# EAGLE design battiny_power_breakout (EAGLE 9.6.2)
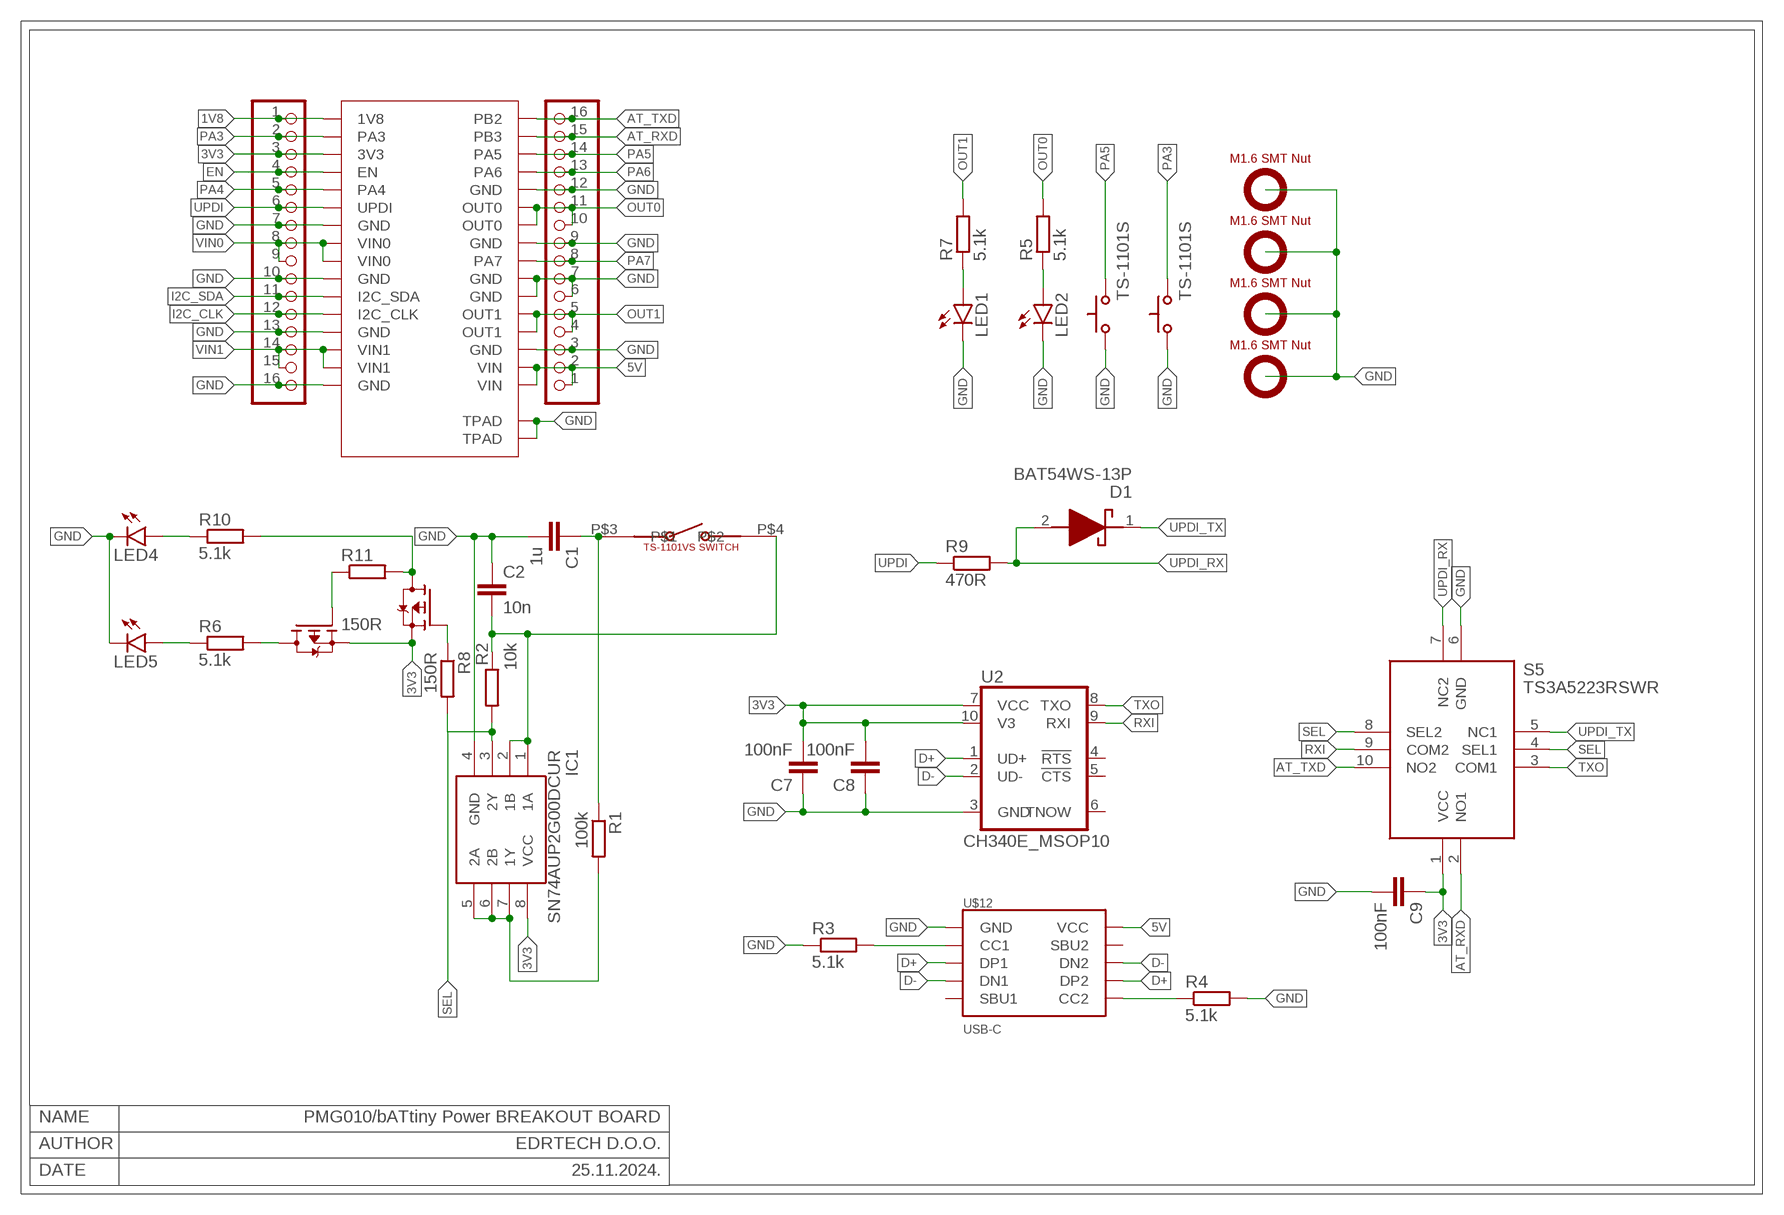
[diagram p0: schematic, sheet 1]

## Parts
C1  1u  C-EUC0402  [C0402]
C2  10n  C-EUC0402  [C0402]
C7  100nF  C-EUC0402  [C0402]
C8  100nF  C-EUC0402  [C0402]
C9  100nF  C-EUC0402  [C0402]
D1  BAT54WS-13P  [SOD2512X115N]
IC1  SN74AUP2G00DCUR  [SOP50P310X90-8N]
JP1  PINHD-1X16  [1X16]
JP2  PINHD-1X16  [1X16]
LED1  LEDCHIP-LED0603  [CHIP-LED0603]
LED2  LEDCHIP-LED0603  [CHIP-LED0603]
LED4  LEDCHIP-LED0603  [CHIP-LED0603]
LED5  LEDCHIP-LED0603  [CHIP-LED0603]
Q1  NTK3139PT1G  [SOTFL40P120X55-3N]
Q2  NTK3139PT1G  [SOTFL40P120X55-3N]
R1  100k  R-EU_R0402  [R0402]
R2  10k  R-EU_R0402  [R0402]
R3  5.1k  R-EU_R0402  [R0402]
R4  5.1k  R-EU_R0402  [R0402]
R5  5.1k  R-EU_R0402  [R0402]
R6  5.1k  R-EU_R0402  [R0402]
R7  5.1k  R-EU_R0402  [R0402]
R8  150R  R-EU_R0402  [R0402]
R9  470R  R-EU_R0402  [R0402]
R10  5.1k  R-EU_R0402  [R0402]
R11  150R  R-EU_R0402  [R0402]
S5  TS3A5223RSWR  [RSW(RPUQFNN10)]
U2  CH340E_MSOP10  [MSOP10]
U$1  TS-1101S  [TS-1101S]
U$2  TS-1101VS-C-A-A  [TS-1101VS-C-A-A]
U$3  PMG010  [PMG010]
U$4  TS-1101S  [TS-1101S]
U$8  SMTSO16  [SMTSO16]
U$9  SMTSO16  [SMTSO16]
U$10  SMTSO16  [SMTSO16]
U$11  SMTSO16  [SMTSO16]
U$12  USB-C  [USB-C]

## Nets
1V8: JP1.1 U$3.P$1(1V8)
3V3: C7.2 C8.2 C9.1 IC1.8(VCC) JP1.3 Q1.2(S) Q2.2(S) S5.1(VCC) U2.7(VCC) U2.10(V3) U$3.P$3(3V3)
5V: JP2.1 JP2.2 U$3.P$17(VIN) U$3.P$18(VIN) U$12.VCC@1(VCC) U$12.VCC@2(VCC)
AT_RXD: JP2.15 S5.2(NO1) U$3.P$31(PB3)
AT_TXD: JP2.16 S5.10(NO2) U$3.P$32(PB2)
D+: U2.1(UD+) U$12.DP1 U$12.DP2
D-: U2.2(UD-) U$12.DN1 U$12.DN2
EN: JP1.4 U$3.P$4(EN)
GND: C1.2 C2.1 C7.1 C8.1 C9.2 IC1.4(GND) JP1.7 JP1.10 JP1.13 JP1.16 JP2.3 JP2.6 JP2.7 JP2.9 JP2.12 LED1.C LED2.C LED4.C LED5.C R3.1 R4.2 S5.6(GND) U2.3(GND) U$1.P$1 U$3.P$7(GND) U$3.P$10(GND) U$3.P$13(GND) U$3.P$16(GND) U$3.P$19(GND) U$3.P$22(GND) U$3.P$23(GND) U$3.P$25(GND) U$3.P$28(GND) U$3.P$33(TPAD) U$3.P$34(TPAD) U$4.P$1 U$8.P$1 U$9.P$1 U$10.P$1 U$11.P$1 U$12.GND@1(GND) U$12.GND@2(GND) U$12.P$1(GND) U$12.P$2(GND) U$12.P$3(GND) U$12.P$4(GND)
I2C_CLK: JP1.12 U$3.P$12(I2C_CLK)
I2C_SDA: JP1.11 U$3.P$11(I2C_SDA)
N$1: C2.2 IC1.1(1A) IC1.2(1B) R2.1 U$2.P$4
N$2: R3.2 U$12.CC1
N$3: LED2.A R5.1
N$4: LED5.A R6.1
N$5: Q1.1(G) R8.1
N$6: R4.1 U$12.CC2
N$7: IC1.5(2A) IC1.6(2B) IC1.7(1Y) R1.2
N$8: Q1.3(D) R10.2 R11.2
N$9: Q2.3(D) R6.2
N$10: LED4.A R10.1
N$11: C1.1 R1.1 U$2.P$3
N$12: Q2.1(G) R11.1
N$13: LED1.A R7.1
OUT0: JP2.10 JP2.11 R5.2 U$3.P$26(OUT0) U$3.P$27(OUT0)
OUT1: JP2.4 JP2.5 R7.2 U$3.P$20(OUT1) U$3.P$21(OUT1)
PA3: JP1.2 U$3.P$2(PA3) U$4.P$2
PA4: JP1.5 U$3.P$5(PA4)
PA5: JP2.14 U$1.P$2 U$3.P$30(PA5)
PA6: JP2.13 U$3.P$29(PA6)
PA7: JP2.8 U$3.P$24(PA7)
RXI: S5.9(COM2) U2.9(RXI)
SEL: IC1.3(2Y) R2.2 R8.2 S5.4(SEL1) S5.8(SEL2)
TXO: S5.3(COM1) U2.8(TXO)
UPDI: JP1.6 R9.1 U$3.P$6(UPDI)
UPDI_RX: D1.2(A) R9.2 S5.7(NC2)
UPDI_TX: D1.1(K) S5.5(NC1)
VIN0: JP1.8 JP1.9 U$3.P$8(VIN0) U$3.P$9(VIN0)
VIN1: JP1.14 JP1.15 U$3.P$14(VIN1) U$3.P$15(VIN1)
Unconnected: U2.4(!RTS) U2.5(!CTS) U2.6(TNOW) U$12.SBU1 U$12.SBU2

## Notes on the sheet
- NAME | PMG010/bATtiny Power BREAKOUT BOARD
- AUTHOR | EDRTECH D.O.O.
- DATE | 25.11.2024.

## Library data of the parts
C1 C2 C7-C9 = rcl:C-EU: CAPACITOR, European symbol; SPICEPREFIX: C
D1 = BAT54WS-13P:BAT54WS-13P: Diode 30 V 200mA Surface Mount SOD-323 Source: Datasheet <https://www.mccsemi.com/pdf/Products/BAT54WS(SOD-323).pdf>; DESCRIPTION: Diode 30 V 200mA Surface Mount SOD-323; HEIGHT: 1.15mm; MANUFACTURER_NAME: MCC; MANUFACTURER_PART_NUMBER: BAT54WS-13P
IC1 = SN74AUP2G00DCUR:SN74AUP2G00DCUR: LOW-POWER DUAL 2-INPUT POSITIVE-NAND GATE Source: Datasheet <http://www.ti.com/lit/gpn/sn74aup2g00>; ARROW_PART_NUMBER: SN74AUP2G00DCUR; ARROW_PRICE-STOCK: https://www.arrow.com/en/products/sn74aup2g00dcur/texas-instruments?region=nac; DESCRIPTION: LOW-POWER DUAL 2-INPUT POSITIVE-NAND GATE; HEIGHT: 0.9mm; MANUFACTURER_NAME: Texas Instruments; MANUFACTURER_PART_NUMBER: SN74AUP2G00DCUR; MOUSER_PART_NUMBER: 595-SN74AUP2G00DCUR; MOUSER_PRICE-STOCK: https://www.mouser.co.uk/ProductDetail/Texas-Instruments/SN74AUP2G00DCUR?qs=%2Fqzd9s%252BcLd4Cllum%2F%252Bgttg%3D%3D
JP1 JP2 = edrtech_lib:PINHD-1X16: PIN HEADER
LED1 LED2 LED4 LED5 = led:LED: LED OSRAM: - CHIPLED LG R971, LG N971, LY N971, LG Q971, LY Q971, LO R971, LY R971 LH N974, LH R974 LS Q976, LO Q976, LY Q976 LO Q996 - Hyper CHIPLED LW Q18S LB Q993, LB Q99A, LB R99A - SideLED LS A670, LO A670, LY A670, LG A670, LP A670 LB A673, LV A673, LT A673, LW A673 LH A674 LY A675 LS A676, LA A676, LO A676, LY A676, LW A676 LS A679, LY A679, LG A679 - Hyper Micro SIDELED® LS Y876, LA Y876, LO Y876, LY Y876 LT Y87S - SmartLED LW L88C, LW L88S LB L89C, LB L89S, LG L890 LS L89K, LO L89K, LY L89K LS L896, LA L896, LO L896, LY L896 - TOPLED LS T670, LO T670, LY T670, LG T670, LP T670 LSG T670, LSP T670, LSY T670, LOP T670, LYG T670 LG T671, LOG T671, LSG T671 LB T673, LV T673, LT T673, LW T673 LH T674 LS T676, LA T676, LO T676, LY T676, LB T676, LH T676, LSB T676, LW T676 LB T67C, LV T67C, LT T67C, LS T67K, LO T67K, LY T67K, LW E67C LS E67B, LA E67B, LO E67B, LY E67B, LB E67C, LV E67C, LT E67C LW T67C LS T679, LY T679, LG T679 LS T770, LO T770, LY T770, LG T770, LP T770 LB T773, LV T773, LT T773, LW T773 LH T774 LS E675, LA E675, LY E675, LS T675 LS T776, LA T776, LO T776, LY T776, LB T776 LHGB T686 LT T68C, LB T68C - Hyper Mini TOPLED® LB M676 - Mini TOPLED Santana® LG M470 LS M47K, LO M47K, LY M47K Source: http://www.osram.convergy.de LUXEON: - LUMILED® LXK2-PW12-R00, LXK2-PW12-S00, LXK2-PW14-U00, LXK2-PW14-V00 LXK2-PM12-R00, LXK2-PM12-S00, LXK2-PM14-U00 LXK2-PE12-Q00, LXK2-PE12-R00, LXK2-PE12-S00, LXK2-PE14-T00, LXK2-PE14-U00 LXK2-PB12-K00, LXK2-PB12-L00, LXK2-PB12-M00, LXK2-PB14-N00, LXK2-PB14-P00, LXK2-PB14-Q00 LXK2-PR12-L00, LXK2-PR12-M00, LXK2-PR14-Q00, LXK2-PR14-R00 LXK2-PD12-Q00, LXK2-PD12-R00, LXK2-PD12-S00 LXK2-PH12-R00, LXK2-PH12-S00 LXK2-PL12-P00, LXK2-PL12-Q00, LXK2-PL12-R00 Source: www.luxeon.com KINGBRIGHT: KA-3528ASYC Source: www.kingbright.com
Q1 Q2 = edrtech_lib:NTK3139PT1G: ON Semiconductor NTK3139PT1G P-channel MOSFET Transistor, 0.87 A, -20 V, 3-Pin SOT-723 Source: Datasheet <http://www.onsemi.com/pub_link/Collateral/NTK3139P-D.PDF>; ARROW_PART_NUMBER: NTK3139PT1G; ARROW_PRICE-STOCK: https://www.arrow.com/en/products/ntk3139pt1g/on-semiconductor; DESCRIPTION: ON Semiconductor NTK3139PT1G P-channel MOSFET Transistor, 0.87 A, -20 V, 3-Pin SOT-723; HEIGHT: 0.55mm; MANUFACTURER_NAME: onsemi; MANUFACTURER_PART_NUMBER: NTK3139PT1G; MOUSER_PART_NUMBER: 863-NTK3139PT1G; MOUSER_PRICE-STOCK: https://www.mouser.co.uk/ProductDetail/onsemi/NTK3139PT1G?qs=g97OBWmz8%2FUOleSHsosIkQ%3D%3D
R1-R11 = rcl:R-EU_: RESISTOR, European symbol; SPICEPREFIX: R
S5 = TS3A5223RSWR:TS3A5223RSWR: 0.5 Dual SPDT Bidirectional Analog Switch Source: Datasheet <http://www.ti.com/lit/gpn/ts3a5223>; ARROW_PART_NUMBER: TS3A5223RSWR; ARROW_PRICE-STOCK: https://www.arrow.com/en/products/ts3a5223rswr/texas-instruments?region=nac; DESCRIPTION: 0.5 Dual SPDT Bidirectional Analog Switch; HEIGHT: mm; MANUFACTURER_NAME: Texas Instruments; MANUFACTURER_PART_NUMBER: TS3A5223RSWR; MOUSER_PART_NUMBER: 595-TS3A5223RSWR; MOUSER_PRICE-STOCK: https://www.mouser.co.uk/ProductDetail/Texas-Instruments/TS3A5223RSWR?qs=nEyf2%252Bd9RBmZJQRiNjZi8g%3D%3D
U2 = CH340E:CH340E: Check availability <https://pricing.snapeda.com/parts/CH340E/WCH/view-part?ref=eda>; AVAILABILITY: Not in stock; CHECK_PRICES: https://www.snapeda.com/parts/CH340E/WCH/view-part/?ref=eda; DESCRIPTION: USB to serial chip CH340; MF: WCH; MP: CH340E; PACKAGE: Package; PRICE: None; SNAPEDA_LINK: https://www.snapeda.com/parts/CH340E/WCH/view-part/?ref=snap
U$1 U$4 = edrtech_lib:TS-1101S
U$2 = circuitmess_device_library:TS-1101VS-C-A-A
U$3 = edrtech_lib:PMG010
U$8-U$11 = edrtech_lib:SMTSO16
U$12 = edrtech_lib:USB-C

## Board
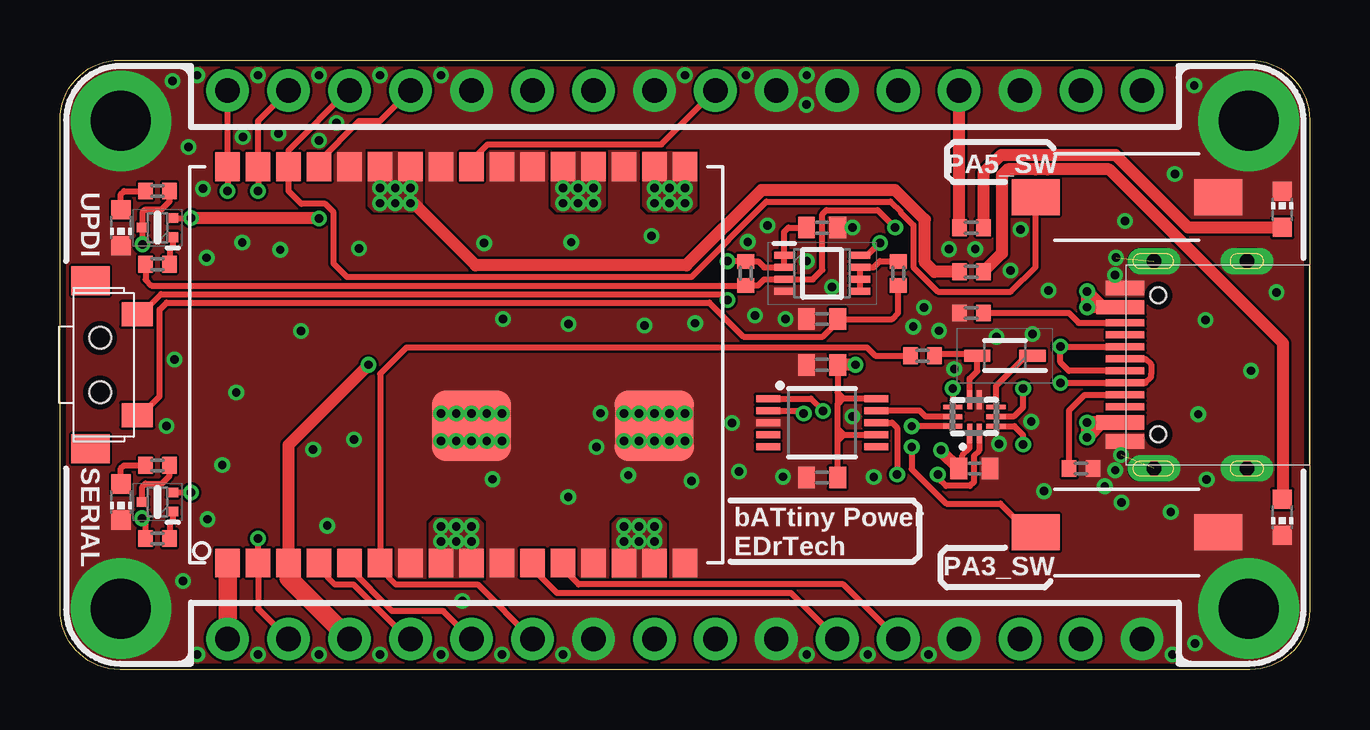
[diagram p1: board, top side]
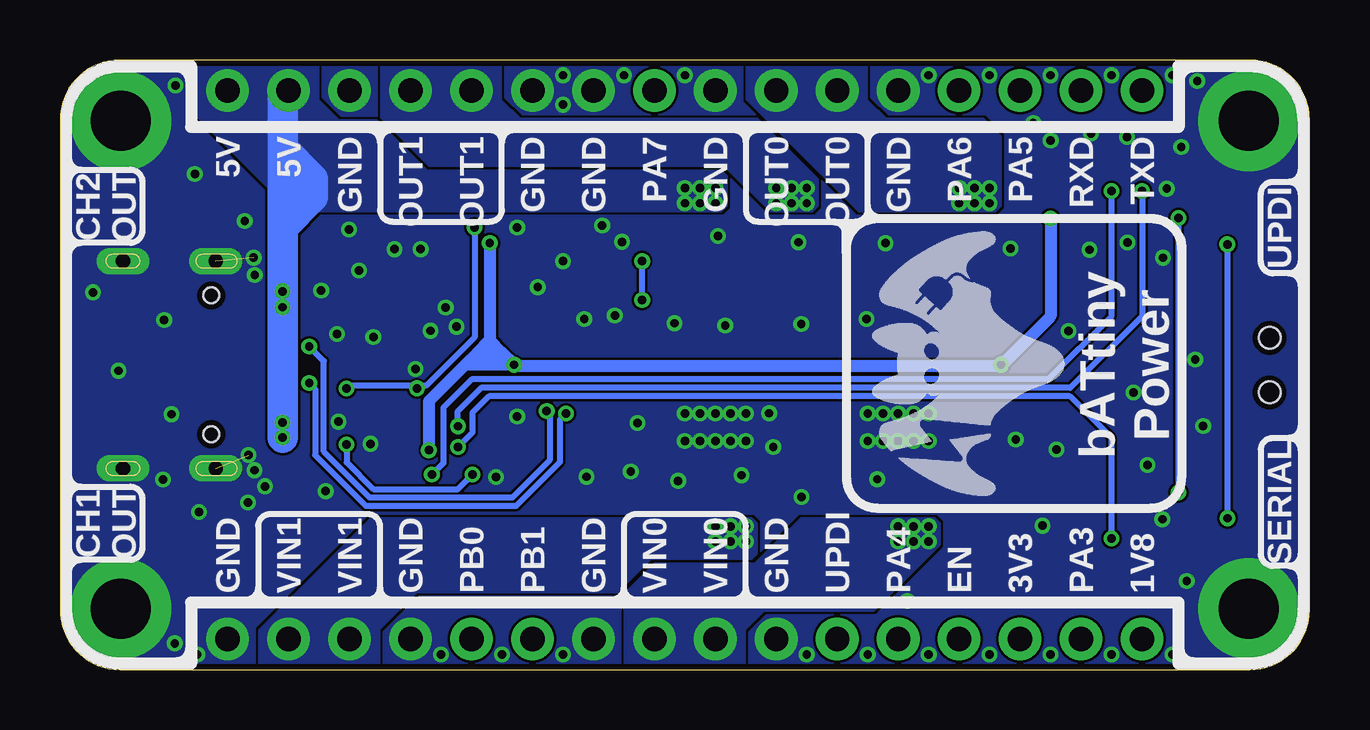
[diagram p2: board, bottom side, seen from below]

Size 52.07 x 25.4 mm. Coordinates in mm from the lower left corner, seen from the top.
Outline: 52.07,22.9 52.07,2.5 arc-90 49.57,0 2.5,0 arc-90 0,2.5 0,22.9 arc-90 2.5,25.4 49.57,25.4 arc-90 52.07,22.9
Copper layers (1*16): Top 0.035mm / dielectric 1.5mm / Bottom 0.035mm
Design rules "dirt_cheap_dirty_boards.v1.1 *": minimum track width 6mil, minimum drill 12mil, track to track 4mil, track to pad 6mil, pad to pad 6mil, via to via 6mil, smd to smd 0mil, copper to edge 10mil, drill to drill 10mil, minimum pad ring 10mil, minimum via ring 6mil, stop-mask expansion 2mil, vias tented up to drill 25mil, thermal gap 10mil

### Footprints (pad centres in the part's own frame; a part is rotated, then mirrored left to right if it is on the bottom)
C0402 = smd 0.7 x 0.9: 1 -0.65,0; 2 0.65,0
SOD2512X115N = smd 1.1 x 0.5: 1 -1.15,0; 2 1.15,0
SOP50P310X90-8N = smd 0.85 x 0.3: 1 -1.575,0.75; 2 -1.575,0.25; 3 -1.575,-0.25; 4 -1.575,-0.75; 5 1.575,-0.75; 6 1.575,-0.25; 7 1.575,0.25; 8 1.575,0.75
1X16 = drill 1.016 pad 1.778: 1 -19.05,0; 2 -16.51,0; 3 -13.97,0; 4 -11.43,0; 5 -8.89,0; 6 -6.35,0; 7 -3.81,0; 8 -1.27,0; 9 1.27,0; 10 3.81,0; 11 6.35,0; 12 8.89,0; 13 11.43,0; 14 13.97,0; 15 16.51,0; 16 19.05,0
CHIP-LED0603 = smd 0.8 x 0.8: A 0,-0.75; C 0,0.75
SOTFL40P120X55-3N = smd 0.465 x 0.4: 1 -0.632,0.4; 2 -0.632,-0.4; 3 0.632,0
R0402 = smd 0.6 x 0.7: 1 -0.5,0; 2 0.5,0
RSW(RPUQFNN10) = smd 0.2 x 0.8: 1 -0.2,-0.7; 2 0.2,-0.7; 6 0.2,0.7; 7 -0.2,0.7 | smd 0.8 x 0.2: 3 0.9,-0.4; 4 0.9,0; 5 0.9,0.4; 8 -0.9,0.4; 9 -0.9,0; 10 -0.9,-0.4
MSOP10 = smd 1 x 0.3: 1 -2.25,1; 2 -2.25,0.5; 3 -2.25,0; 4 -2.25,-0.5; 5 -2.25,-1; 6 2.25,-1; 7 2.25,-0.5; 8 2.25,0; 9 2.25,0.5; 10 2.25,1
TS-1101S = smd 2 x 1.5: P$1 -3.8,0; P$2 3.8,0
TS-1101VS-C-A-A = smd 1.2 x 1.6: GND -3.5,0; GND@1 3.5,0 | smd 1 x 1.3: P$3 -2.1,-1.95; P$4 2.1,-1.95 | hole 0.9: -1.15,-0.4; 1.12,-0.4
PMG010 = smd 1.194 x 1.016: P$1 -8.255,9.525; P$2 -8.255,8.255; P$3 -8.255,6.985; P$4 -8.255,5.715; P$5 -8.255,4.445; P$6 -8.255,3.175; P$7 -8.255,1.905; P$8 -8.255,0.635; P$9 -8.255,-0.635; P$10 -8.255,-1.905; P$11 -8.255,-3.175; P$12 -8.255,-4.445; P$13 -8.255,-5.715; P$14 -8.255,-6.985; P$15 -8.255,-8.255; P$16 -8.255,-9.525; P$17 8.255,-9.525; P$18 8.255,-8.255; P$19 8.255,-6.985; P$20 8.255,-5.715; P$21 8.255,-4.445; P$22 8.255,-3.175; P$23 8.255,-1.905; P$24 8.255,-0.635; P$25 8.255,0.635; P$26 8.255,1.905; P$27 8.255,3.175; P$28 8.255,4.445; P$29 8.255,5.715; P$30 8.255,6.985; P$31 8.255,8.255; P$32 8.255,9.525 | smd 2.921 x 3.302: P$33 -2.54,-8.255; P$34 -2.54,-0.635
SMTSO16 = drill 2.5 pad 4.19: P$1 0,0
USB-C = smd 0.3 x 1.6: CC1 -1.25,3.88; CC2 1.75,3.88; DN1 0.25,3.88; DN2 -0.75,3.88; DP1 -0.25,3.88; DP2 0.75,3.88; SBU1 1.25,3.88; SBU2 -1.75,3.88 | smd 0.6 x 1.6: GND@1 -3.2,3.88; GND@2 3.2,3.88 | drill 0.6 pad 1 long: P$1 -4.32,-1.19; P$2 4.32,-1.19; P$3 4.32,2.68; P$4 -4.32,2.68 | smd 0.6 x 2: VCC@1 -2.4,4.08; VCC@2 2.4,4.08 | hole 0.65: 2.89,2.49; -2.89,2.49

### Placement (x,y rotation side)
C1  31.75,14.61 180 top
C2  31.75,18.41 180 top
C7  31.75,12.7 0 top
C8  31.75,8 0 top
C9  38.1,8.38 0 top
D1  39.37,13.08 180 top
IC1  31.75,16.51 0 top
JP1  26.04,1.27 0 top
JP2  26.04,24.13 180 top
LED1  50.93,19.18 0 top
LED2  50.93,6.35 180 top
LED4  2.54,18.41 180 top
LED5  2.54,6.99 180 top
Q1  4.06,18.41 180 top
Q2  4.06,6.99 180 top
R1  34.92,16.51 90 top
R2  28.57,16.51 270 top
R3  42.55,8.38 180 top
R4  37.97,14.86 180 top
R5  37.97,16.57 180 top
R6  4.06,8.51 0 top
R7  37.97,18.41 180 top
R8  4.06,16.89 180 top
R9  35.94,13.08 0 top
R10  4.06,19.94 0 top
R11  4.06,5.46 180 top
S5  38.1,10.54 0 top
U2  31.75,10.29 0 top
U$1  44.45,19.68 180 top
U$2  1.27,12.7 90 top
U$3  16.51,12.7 90 top
U$4  44.45,5.71 180 top
U$8  49.53,2.54 90 top
U$9  49.53,22.86 90 top
U$10  2.54,2.54 90 top
U$11  2.54,22.86 90 top
U$12  48.26,12.7 90 top

### Tracks (layer width: path | path; a pad name or v marks a point on that pad's centre or on a via)
1V8
  Top 0.762: U$3.P$1 JP1.1
3V3  (via drill 0.35)
  Top 0.254: Q2.2 v5.46,7.38 | Q1.2 v5.46,18.82 | C8.2 32.4,9.54 | 32.65,9.79 U2.7 | 32.4,9.54 32.65,9.79 | 32.4,9.54 32.4,10.03 | 32.4,10.03 32.4,11.06 | 32.4,11.06 32.64,11.3 | 32.64,11.3 33.98,11.3 U2.10 | 32.65,9.79 32.4,10.03 | C7.2 32.4,11.54 | 32.4,11.54 32.64,11.3 | 32.4,11.54 32.4,11.06 | C9.1 37.6,8.53 37.6,8.93 37.9,9.23 S5.1 | IC1.8 33.64,17.26 v34.16,17.78
  Top 0.508: v33.15,12.7 C7.2 | v36.7,9.14 36.7,9.13 C9.1 | v10.79,18.8 5.48,18.8 v5.46,18.82 | U$3.P$3 9.53,9.37 v12.86,12.7
  Top 0.762: JP1.3 9.53,3.81 U$3.P$3
  Bottom 0.254: v5.46,7.38 v5.46,18.82
  Bottom 0.508: v10.79,18.8 10.79,14.73 12.86,12.66 | 12.86,12.66 33.11,12.66 v33.15,12.7 | v33.15,12.7 33.66,13.21 | 33.66,13.21 34.16,13.72 | v34.16,17.78 34.16,13.72 | v33.15,12.7 35.18,12.7 | 35.18,12.7 36.7,11.18 v36.7,9.14 | 35.18,12.7 34.67,13.21 | 34.67,13.21 34.16,13.72 | 34.67,13.21 33.66,13.21 | v12.86,12.7 12.86,12.66
5V  (via drill 0.35)
  Top 0.254: U$3.P$18 v24.77,20.07
  Top 0.508: U$12.VCC@2 v42.8,15.1 v42.8,15.76 43.45,15.11 44.32,15.11 44.31,15.1 U$12.VCC@2 | U$12.VCC@1 v42.8,10.3 v42.8,9.66 43.43,10.3 U$12.VCC@1
  Bottom 1.27: v42.8,9.66 v42.8,10.3 v42.8,15.1 v42.8,15.76 42.8,18.41 | 42.8,18.41 42.8,21.72 | 42.8,21.72 42.8,23.88 JP2.2 | 42.8,18.41 41.53,19.68 41.53,20.45 42.8,21.72
  other vias: 25.4,20.07 26.04,20.07 24.77,19.43 25.4,19.43 26.04,19.43
  pour Top (no thermals): 24.26,21.59 24.26,19.3 24.51,19.05 26.29,19.05 26.54,19.3 26.54,21.59
  pour Bottom (no thermals): 24.51,19.05 24.26,19.3 24.26,20.57 24.51,20.83 36.77,20.83 38.86,22.92 40.45,22.92 41.27,23.75 41.27,25.4 46.35,25.4 46.35,22.99 42.42,19.05
AT_RXD  (via drill 0.35)
  Top 0.254: S5.2 38.3,9.13 38.08,8.91 38.08,7.82 37.92,7.65 36.92,7.65 36.58,8 v36.58,8.13 | v8.26,19.94 U$3.P$31 8.26,22.86 JP2.15
  Bottom 0.254: v36.58,8.13 36.1,8.61 36.1,10.91 34.91,12.09 10.89,12.09 8.26,14.73 v8.26,19.94
AT_TXD  (via drill 0.35)
  Top 0.254: S5.10 v35.49,10.14 | v6.99,19.94 U$3.P$32 JP2.16
  Bottom 0.254: v6.99,19.94 6.99,14.73 9.98,11.74 34.52,11.74 35.49,10.77 v35.49,10.14
D+  (via drill 0.35)
  Top 0.254: U2.1 31.28,11.29 v31.79,10.78 | U$12.DP2 44.37,13.46 v41.68,13.46 41.68,12.8 42.03,12.45 U$12.DP1
  Bottom 0.254: v31.79,10.78 31.67,10.65 31.67,8.72 33.22,7.17 39.16,7.17 41.08,9.08 41.08,12.86 v41.68,13.46
D-  (via drill 0.35)
  Top 0.254: U2.2 30.87,10.79 v30.99,10.67 | v41.68,11.94 44.37,11.94 U$12.DN2 45.23,11.95 45.46,12.18 45.46,12.31 45.47,12.32 45.46,12.33 45.46,12.72 45.23,12.95 U$12.DN1
  Bottom 0.254: v30.99,10.67 31.24,10.41 31.24,8.64 33.07,6.81 39.31,6.81 41.44,8.94 41.44,11.7 v41.68,11.94
EN
  Top 0.254: U$3.P$4 10.79,4.21 11.45,3.56 12.22,3.56 14.51,1.27 JP1.4
GND  (via drill 0.35)  (2 unrouted)
  other vias: 30.23,14.61 31.11,17.02 33.02,18.41 10.79,0.64 13.34,0.64 15.88,0.64 18.41,0.64 20.95,0.64 31.11,0.64 36.2,0.64 33.02,10.54 8.26,24.77 10.79,24.77 13.34,24.77 15.88,24.77 26.04,24.77 31.11,24.77 33.66,0.64 46.35,0.64 8.26,0.64 5.71,0.64 5.71,24.77 28.57,24.77 28.66,17.82 29.48,18.51 32.17,15.93 28.95,14.76 36,15.09 35.55,14.29 26.47,14.43 24.35,14.33 21.18,14.4 18.46,14.61 22.52,10.68 22.35,9.27 23.68,8.1 18.02,7.93 12.25,9.58 11.14,6 10.55,9.16 6.76,8.52 6.14,6.26 5.12,3.69 4.44,10.15 4.77,12.92 7.34,11.55 10.04,14.11 12.46,17.55 9.18,17.49 7.59,17.8 6.11,17.16 5.95,20.04 24.65,18.06 21.3,17.81 17.67,17.77 5.35,21.78 21.18,7.19 26.31,7.87 28.29,8.26 28,10.27 30.13,8.04 41,7.43 44.23,6.96 40.47,10.33 39.13,9.41 40.53,13.98 39.02,13.86 41.19,15.79 40.03,18.33 39.61,16.63 38.13,17.52 37.04,17.52 31.11,23.54 46.45,20.65 47.26,24.34 44.37,18.69 47.73,14.57 50.69,15.72 49.63,12.45 47.43,10.64 46.28,6.57 47.78,7.92 47.29,1.09 33.91,8.03 36.63,14.12 43.96,16.44 44,17.16 44.21,8.94 43.97,8.31 43.53,7.64 15.88,10.67 16.51,10.67 17.14,10.67 17.78,10.67 18.41,10.67 15.88,9.53 16.51,9.53 17.14,9.53 17.78,9.53 18.41,9.53 23.5,10.67 24.13,10.67 24.77,10.67 25.4,10.67 26.04,10.67 23.5,9.53 24.13,9.53 24.77,9.53 25.4,9.53 26.04,9.53 16.76,2.86 10.79,22.04 11.52,22.77 9.11,22.34 7.62,22.19 4.68,24.52 37.26,12.53
  pour Top (rank 6, no thermals): 2.5,0 49.57,0 arc90 52.07,2.5 52.07,22.9 arc90 49.57,25.4 2.5,25.4 arc90 0,22.9 0,2.5 arc90
  pour Bottom (rank 6, no thermals): 2.5,0 49.57,0 arc90 52.07,2.5 52.07,22.9 arc90 49.57,25.4 2.5,25.4 arc90 0,22.9 0,2.5 arc90
  pour Top (rank 5, no thermals): 41,5 47,5 47,2 41,2
I2C_CLK
  Top 0.254: JP1.12 32.64,3.56 21.61,3.56 20.95,4.21 U$3.P$12
I2C_SDA
  Top 0.254: U$3.P$11 19.68,4.21 20.7,3.2 30.45,3.2 JP1.11
N$1  (via drill 0.35)
  Top 0.254: U$2.P$4 3.37,14.8 4.22,15.65 27.56,15.65 v27.81,15.39 | v27.81,17.02 27.82,17.01 R2.1 29.09,17.01 29.34,16.76 IC1.2 IC1.1 30.18,18.24 30.35,18.41 C2.2
  Bottom 0.254: v27.81,15.39 v27.81,17.02
N$2
  Top 0.254: R3.2 42.05,10.8 42.69,11.45 U$12.CC1
N$3
  Top 0.508: LED2.A 50.96,7.14 50.96,13.59 43.72,20.84 41.15,20.84 40.64,20.84 39.48,20.84 39.24,20.6 39.24,17.34 R5.1
N$4
  Top 0.254: LED5.A 2.54,8.38 2.67,8.51 R6.1
N$5
  Top 0.254: Q1.1 4.7,17.65 4.56,17.52 R8.1
N$6
  Top 0.254: U$12.CC2 42.45,14.45 42.04,14.86 R4.1
N$7
  Top 0.254: IC1.5 IC1.6 IC1.7 33.91,16.76 34.16,17.02 R1.2
N$8  (via drill 0.35)
  Top 0.254: R10.2 4.56,19.51 4.23,19.18 3.56,19.18 3.43,19.05 Q1.3 v3.43,17.72 | R11.2 3.56,6.16 v3.42,6.3
  Bottom 0.254: v3.42,6.3 3.42,17.71 v3.43,17.72
N$9
  Top 0.254: Q2.3 3.43,7.62 3.56,7.75 4.23,7.75 4.56,8.08 R6.2
N$10
  Top 0.254: LED4.A 2.54,19.81 2.67,19.94 R10.1
N$11
  Top 0.254: R1.1 34.92,14.86 34.67,14.61 C1.1 32.4,14.49 31.78,13.88 28.47,13.88 27.06,15.29 4.45,15.29 4.15,14.99 4.15,11.39 3.36,10.6 U$2.P$3
N$12
  Top 0.254: Q2.1 4.7,6.22 4.56,6.09 R11.1
N$13
  Top 0.508: R7.1 38.47,20.7 39.23,21.45 43.97,21.45 46.99,18.43 LED1.A
OUT0  (via drill 0.35)
  Top 0.254: U$3.P$27 v13.34,20.07
  Top 0.508: R5.2 36.43,16.57 36.04,16.97 36.04,18.75 34.8,19.98 29.24,19.98 26.09,16.84 17.32,16.84 14.73,19.43 v14.61,19.43
  other vias: 13.34,19.43 13.97,20.07 13.97,19.43 14.61,20.07
  pour Top (no thermals): 12.83,21.59 12.83,19.3 13.08,19.05 14.86,19.05 15.11,19.3 15.11,21.59
  pour Bottom (no thermals): 23.5,25.4 23.5,23.75 21.84,22.1 18.8,19.05 14.73,19.05 13.08,19.05 12.83,19.3 12.83,22.23 13.59,22.99 17.65,22.99 18.41,23.75 18.41,25.4
OUT1  (via drill 0.35)
  Top 0.254: U$3.P$21 v20.95,20.07
  Top 0.508: R7.2 JP2.4
  other vias: 21.59,20.07 22.23,20.07 20.95,19.43 21.59,19.43 22.23,19.43
  pour Top (no thermals): 20.45,21.59 20.45,19.3 20.7,19.05 22.48,19.05 22.73,19.3 22.73,21.59
  pour Bottom (no thermals): 20.7,19.05 20.45,19.3 20.45,20.45 22.99,22.99 32.89,22.99 33.66,23.75 33.66,25.4 38.73,25.4 38.73,22.99 36.7,20.95 24.38,20.95 22.48,19.05
PA3  (via drill 0.35)
  Top 0.254: v35.49,9.27 35.49,8.36 36.93,6.92 39.19,6.92 40.39,5.71 U$4.P$2 | v8.26,5.46 U$3.P$2 8.26,2.54 JP1.2
  Bottom 0.254: v35.49,9.27 34.88,9.88 34.88,10.7 34.2,11.38 9.98,11.38 8.26,9.65 v8.26,5.46
PA4
  Top 0.254: JP1.5 15.98,2.44 13.84,2.44 12.06,4.21 U$3.P$5
PA5
  Top 0.254: JP2.14 12.02,24.13 9.53,21.64 U$3.P$30 9.53,19.94 10.06,19.4 11.05,19.4 11.4,19.05 11.4,16.92 11.96,16.36 26.29,16.36 29.44,19.5 34.6,19.5 35.05,19.05 35.05,19.02 35.55,18.52 35.55,16.77 36.58,15.75 39.62,15.75 40.65,16.77 U$1.P$2
PA6
  Top 0.254: U$3.P$29 10.79,21.19 12.47,22.86 13.34,22.86 JP2.13
PA7
  Top 0.254: U$3.P$24 17.14,21.21 17.82,21.88 25.06,21.88 JP2.8
RXI
  Top 0.254: S5.9 36.07,10.54 35.82,10.79 U2.9
SEL  (via drill 0.35)
  Top 0.254: R8.2 3.56,16.25 3.81,16 R2.2 29.09,16.01 29.34,16.26 IC1.3 31.37,16.26 31.77,16.66 31.77,18.98 31.93,19.14 34.07,19.14 v34.8,18.41 | S5.4 39.02,10.56 39.77,10.56 40.13,10.92 v40.13,11.71 | v37.2,11.72 S5.8
  Bottom 0.254: v40.13,11.71 40.01,11.83 37.31,11.83 | v37.2,11.72 37.31,11.83 | 37.31,11.83 36.81,11.83 34.8,13.84 v34.8,18.41
TXO  (via drill 0.35)
  Top 0.254: U2.8 34.67,10.29 34.88,10.07 v34.88,8.13 | v40.13,9.38 40.13,9.77 39.76,10.14 S5.3
  Bottom 0.254: v34.88,8.13 35.49,7.52 39.02,7.52 40.13,8.64 v40.13,9.38
UPDI
  Top 0.254: R9.1 33.97,13.08 33.62,13.43 14.45,13.43 13.34,12.32 U$3.P$6 13.34,4.21 13.99,3.56 17.4,3.56 JP1.6
UPDI_RX
  Top 0.254: S5.7 37.9,12.12 38.22,12.44 D1.2 38.16,13.14 36.5,13.14 R9.2
UPDI_TX
  Top 0.254: S5.5 39,11.82 40.26,13.08 D1.1
VIN0  (via drill 0.35)
  Top 0.254: U$3.P$8 v15.88,5.33
  other vias: 17.14,5.33 16.51,5.33 15.88,5.97 16.51,5.97 17.14,5.97
  pour Top (no thermals): 15.37,3.81 15.37,6.1 15.62,6.35 17.4,6.35 17.65,6.1 17.65,3.81
  pour Bottom (no thermals): 15.37,6.1 15.37,5.21 18.16,2.41 22.73,2.41 23.5,1.65 23.5,0 28.57,0 28.57,3.17 27.3,4.45 23.11,4.45 21.21,6.35 15.62,6.35
VIN1  (via drill 0.35)
  Top 0.254: U$3.P$14 v23.5,5.33
  other vias: 23.5,5.97 24.13,5.33 24.77,5.33 24.13,5.97 24.77,5.97
  pour Top (no thermals): 22.99,3.81 22.99,6.1 23.24,6.35 25.02,6.35 25.27,6.1 25.27,3.81
  pour Bottom (no thermals): 22.99,6.1 23.24,6.35 39.12,6.35 43.81,1.65 43.81,0 38.73,0 38.73,1.65 37.21,3.17 28.83,3.17 27.43,4.57 23.24,4.57 22.99,4.83

### Text on the board
tPlace: PA5_SW | UPDI | SERIAL | bATtiny Power / EDrTech | PA3_SW
bPlace: TXD | RXD | PA5 | PA6 | GND | OUT0 | OUT0 | GND | PA7 | GND | GND | OUT1 | OUT1 | GND | 5V | 5V | CH2 / OUT | UPDI | bATtiny / Power | SERIAL | CH1 / OUT | 1V8 | PA3 | 3V3 | EN | PA4 | UPDI | GND | VIN0 | VIN0 | GND | PB1 | PB0 | GND | VIN1 | VIN1 | GND
tStop: EDrTech